# EAGLE design Big LED Controller Board (EAGLE 5.06)
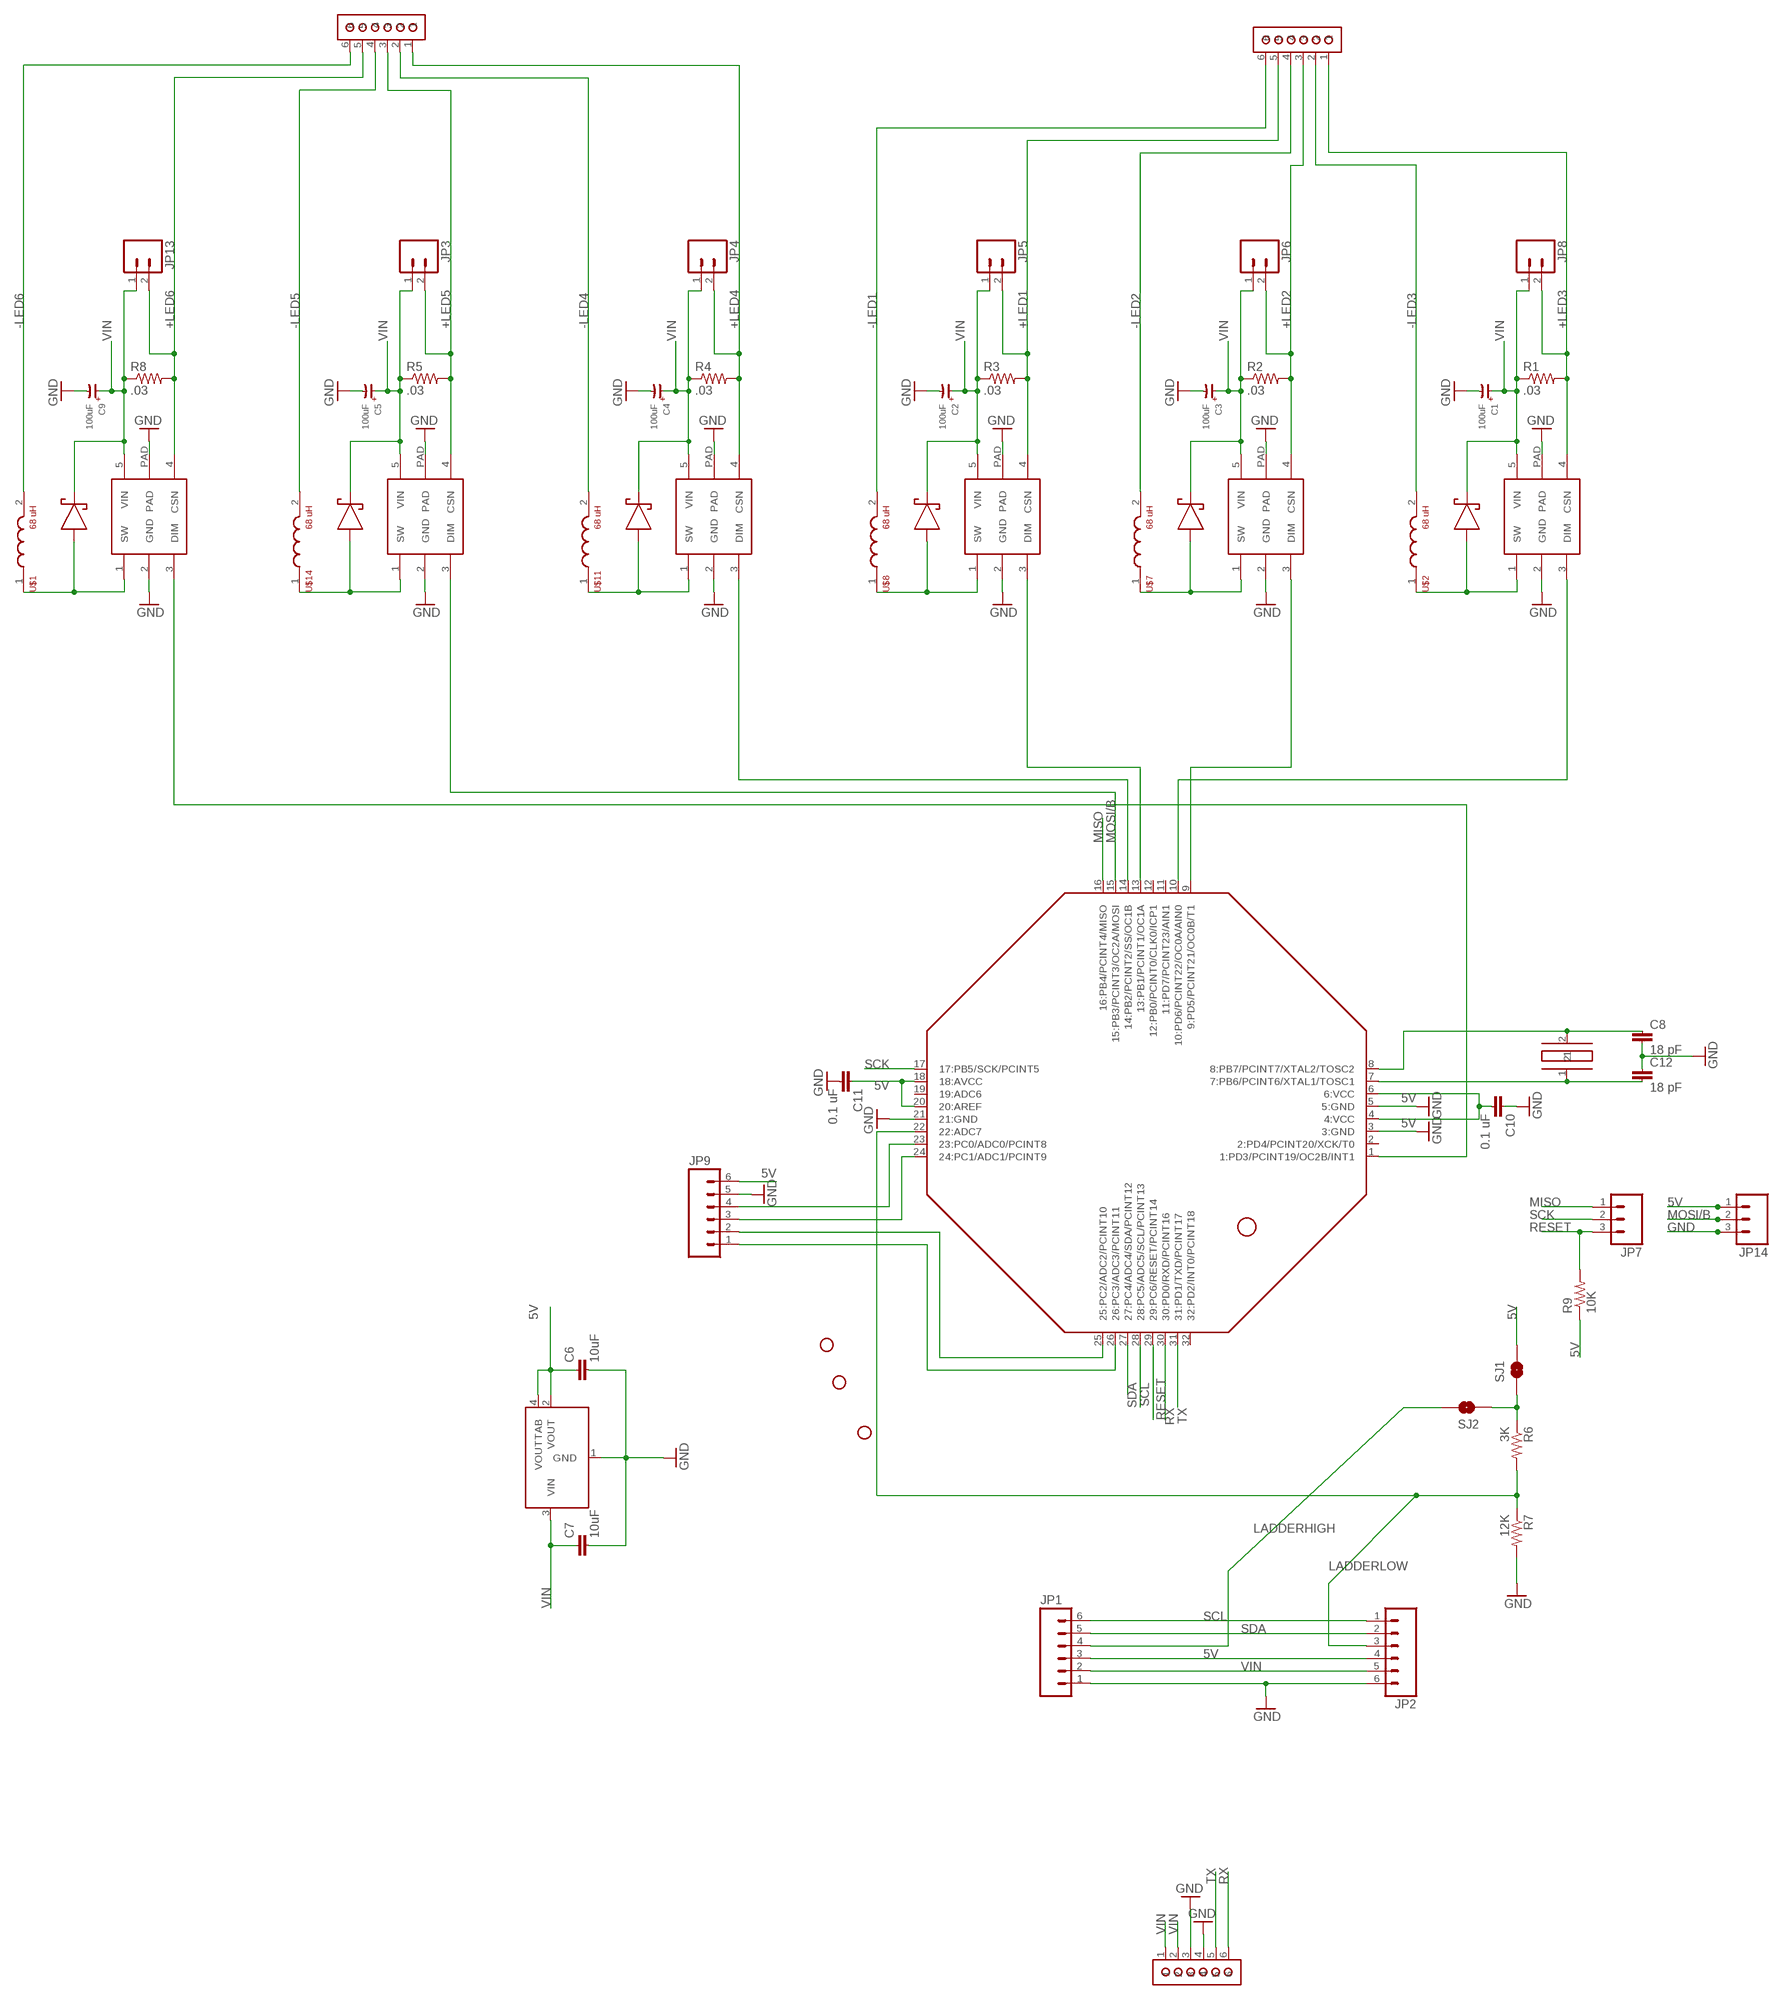
[diagram p0: schematic, sheet 1]

## Parts
C1  100uF  CAPPOL-8X11  [8MMCAP]
C2  100uF  CAPPOL-8X11  [8MMCAP]
C3  100uF  CAPPOL-8X11  [8MMCAP]
C4  100uF  CAPPOL-8X11  [8MMCAP]
C5  100uF  CAPPOL-8X11  [8MMCAP]
C6  10uF  CAP0805  [0805]
C7  10uF  CAP0805  [0805]
C8  18 pF  CAP0603-CAP  [0603-CAP]
C9  100uF  CAPPOL-8X11  [8MMCAP]
C10  0.1 uF  CAP0805  [0805]
C11  0.1 uF  CAP0805  [0805]
C12  18 pF  CAP0603-CAP  [0603-CAP]
JP1  M06_HERM  [1X06_HERM_CONN]
JP2  M06_HERM  [1X06_HERM_CONN]
JP3  M02LOCK  [1X02_LOCK]
JP4  M02LOCK  [1X02_LOCK]
JP5  M02LOCK  [1X02_LOCK]
JP6  M02LOCK  [1X02_LOCK]
JP7  M03LOCK  [1X03_LOCK]
JP8  M02LOCK  [1X02_LOCK]
JP9  M06LOCK  [1X06_LOCK]
JP10  STAND-OFFTIGHT  [STAND-OFF-TIGHT]
JP11  STAND-OFFTIGHT  [STAND-OFF-TIGHT]
JP12  STAND-OFFTIGHT  [STAND-OFF-TIGHT]
JP13  M02LOCK  [1X02_LOCK]
JP14  M03LOCK  [1X03_LOCK]
R1  .03  RESISTOR1206  [1206]
R2  .03  RESISTOR1206  [1206]
R3  .03  RESISTOR1206  [1206]
R4  .03  RESISTOR1206  [1206]
R5  .03  RESISTOR1206  [1206]
R6  3K  RESISTOR0603-RES  [0603-RES]
R7  12K  RESISTOR0603-RES  [0603-RES]
R8  .03  RESISTOR1206  [1206]
R9  10K  RESISTOR  [0805]
SJ1  SOLDERJUMPERNO  [SJ_2S-NO]
SJ2  SOLDERJUMPERNO  [SJ_2S-NO]
U$1  68 uH  INDUCTORVLF10040  [VLF10040]
U$2  68 uH  INDUCTORVLF10040  [VLF10040]
U$3  SCHOTTKY_DIODE-SS18  [DO-214]
U$4  PT4115  [SOT89-5]
U$5  PT4115  [SOT89-5]
U$6  PT4115  [SOT89-5]
U$7  68 uH  INDUCTORVLF10040  [VLF10040]
U$8  68 uH  INDUCTORVLF10040  [VLF10040]
U$9  SCHOTTKY_DIODE-SS18  [DO-214]
U$10  SCHOTTKY_DIODE-SS18  [DO-214]
U$11  68 uH  INDUCTORVLF10040  [VLF10040]
U$12  SCHOTTKY_DIODE-SS18  [DO-214]
U$13  PT4115  [SOT89-5]
U$14  68 uH  INDUCTORVLF10040  [VLF10040]
U$15  SCHOTTKY_DIODE-SS18  [DO-214]
U$16  PT4115  [SOT89-5]
U$17  5V-LDO-DPAK3  [DPAK3]
U$18  SCREWTERM-6-MA212-6  [MA212-6]
U$19  SCREWTERM-6-MA212-6  [MA212-6]
U$21  SCREWTERM-6-MA212-6  [MA212-6]
U$22  ATMEGA328TQFP  [TQFP32]
U$23  SCHOTTKY_DIODE-SS18  [DO-214]
U$24  PT4115  [SOT89-5]
U$26  HC49US  [HC49US]

## Nets
5V: C6.1 C10.2 C11.1 JP1.3 JP2.4 JP9.6 JP14.1 R9.1 SJ1.2 U$17.2(VOUT) U$17.4(VOUTTAB) U$22.4(4:VCC) U$22.6(6:VCC) U$22.18(18:AVCC) U$22.20(20:AREF)
+LED1: JP5.2 R3.2 U$4.4(CSN) U$18.5
+LED2: JP6.2 R2.2 U$5.4(CSN) U$18.3
+LED3: JP8.2 R1.2 U$6.4(CSN) U$18.1
+LED4: JP4.2 R4.2 U$13.4(CSN) U$19.1
+LED5: JP3.2 R5.2 U$16.4(CSN) U$19.3
+LED6: JP13.2 R8.2 U$19.5 U$24.4(CSN)
-LED1: U$8.2 U$18.6
-LED2: U$7.2 U$18.4
-LED3: U$2.2 U$18.2
-LED4: U$11.2 U$19.2
-LED5: U$14.2 U$19.4
-LED6: U$1.2 U$19.6
A: U$22.1(1:PD3/PCINT19/OC2B/INT1) U$24.3(DIM)
A1: JP9.4 U$22.23(23:PC0/ADC0/PCINT8)
A2: JP9.3 U$22.24(24:PC1/ADC1/PCINT9)
A3: JP9.2 U$22.25(25:PC2/ADC2/PCINT10)
A4: JP9.1 U$22.26(26:PC3/ADC3/PCINT11)
C: U$13.3(DIM) U$22.14(14:PB2/PCINT2/SS/OC1B)
D: U$4.3(DIM) U$22.13(13:PB1/PCINT1/OC1A)
E: U$5.3(DIM) U$22.9(9:PD5/PCINT21/OC0B/T1)
F: U$6.3(DIM) U$22.10(10:PD6/PCINT22/OC0A/AIN0)
GND: C1.- C2.- C3.- C4.- C5.- C6.2 C7.2 C8.2 C9.- C10.1 C11.2 C12.1 JP1.1 JP2.6 JP9.5 JP14.3 R7.2 U$4.2(GND) U$4.PAD U$5.2(GND) U$5.PAD U$6.2(GND) U$6.PAD U$13.2(GND) U$13.PAD U$16.2(GND) U$16.PAD U$17.1(GND) U$21.3 U$21.4 U$22.3(3:GND) U$22.5(5:GND) U$22.21(21:GND) U$24.2(GND) U$24.PAD
LADDERHIGH: JP1.4 SJ2.2
LADDERLOW: JP2.3 R6.2 R7.1 U$22.22(22:ADC7)
MISO: JP7.1 U$22.16(16:PB4/PCINT4/MISO)
MOSI/B: JP14.2 U$16.3(DIM) U$22.15(15:PB3/PCINT3/OC2A/MOSI)
N$5: R6.1 SJ1.1 SJ2.1
N$21: C8.1 U$22.8(8:PB7/PCINT7/XTAL2/TOSC2) U$26.2
N$22: C12.2 U$22.7(7:PB6/PCINT6/XTAL1/TOSC1) U$26.1
RESET: JP7.3 R9.2 U$22.29(29:PC6/RESET/PCINT14)
RX: U$21.6 U$22.30(30:PD0/RXD/PCINT16)
SCK: JP7.2 U$22.17(17:PB5/SCK/PCINT5)
SCL: JP1.6 JP2.1 U$22.28(28:PC5/ADC5/SCL/PCINT13)
SDA: JP1.5 JP2.2 U$22.27(27:PC4/ADC4/SDA/PCINT12)
SW1: U$4.1(SW) U$8.1 U$10.P$2(ANODE)
SW2: U$5.1(SW) U$7.1 U$9.P$2(ANODE)
SW3: U$2.1 U$3.P$2(ANODE) U$6.1(SW)
SW4: U$11.1 U$12.P$2(ANODE) U$13.1(SW)
SW5: U$14.1 U$15.P$2(ANODE) U$16.1(SW)
SW6: U$1.1 U$23.P$2(ANODE) U$24.1(SW)
TX: U$21.5 U$22.31(31:PD1/TXD/PCINT17)
VIN: C1.+ C2.+ C3.+ C4.+ C5.+ C7.1 C9.+ JP1.2 JP2.5 JP3.1 JP4.1 JP5.1 JP6.1 JP8.1 JP13.1 R1.1 R2.1 R3.1 R4.1 R5.1 R8.1 U$3.P$1(CATHODE) U$4.5(VIN) U$5.5(VIN) U$6.5(VIN) U$9.P$1(CATHODE) U$10.P$1(CATHODE) U$12.P$1(CATHODE) U$13.5(VIN) U$15.P$1(CATHODE) U$16.5(VIN) U$17.3(VIN) U$21.1 U$21.2 U$23.P$1(CATHODE) U$24.5(VIN)
Unconnected: U$22.2(2:PD4/PCINT20/XCK/T0) U$22.11(11:PD7/PCINT23/AIN1) U$22.12(12:PB0/PCINT0/CLK0/ICP1) U$22.19(19:ADC6) U$22.32(32:PD2/INT0/PCINT18)

## Library data of the parts
C1-C5 C9 = 1dah:CAPPOL
C6-C8 C10-C12 = 1dah:CAP: Capacitor Standard 0603 ceramic capacitor, and 0.1" leaded capacitor.
JP1 JP2 JP9 = 1dah:M06: Header 6 Standard 6-pin 0.1" header. Use with straight break away headers (SKU : PRT-00116), right angle break away headers (PRT-00553), swiss pins (PRT-00743), machine pins (PRT-00117), and female headers (PRT-00115). Molex polarized connector foot print use with SKU : PRT-08094 with associated crimp pins and housings. NOTES ON THE VARIANTS LOCK and LOCK_LONGPADS... This footprint was designed to help hold the alignment of a through-hole component (i.e. 6-pin header) while soldering it into place. You may notice that each hole has been shifted either up or down by 0.005 of an inch from it's more standard position (which is a perfectly straight line). This slight alteration caused the pins (the squares in the middle) to touch the edges of the holes. Because they are alternating, it causes a "brace" to hold the component in place. 0.005 has proven to be the perfect amount of "off-center" position when using our standard breakaway headers. Although looks a little odd when you look at the bare footprint, once you have a header in there, the alteration is very hard to notice. Also, if you push a header all the way into place, it is covered up entirely on the bottom side. This idea of altering the position of holes to aid alignment will be further integrated into the Sparkfun Library for other footprints. It can help hold any component with 3 or more connection pins.
JP3-JP6 JP8 JP13 = 1dah:M02: Header 2 Standard 2-pin 0.1" header. Use with straight break away headers (SKU : PRT-00116), right angle break away headers (PRT-00553), swiss pins (PRT-00743), machine pins (PRT-00117), and female headers (PRT-00115). Molex polarized connector foot print use with SKU : PRT-08233 with associated crimp pins and housings.
JP7 JP14 = 1dah:M03: Header 3 Standard 3-pin 0.1" header. Use with straight break away headers (SKU : PRT-00116), right angle break away headers (PRT-00553), swiss pins (PRT-00743), machine pins (PRT-00117), and female headers (PRT-00115). Molex polarized connector foot print use with SKU : PRT-08232 with associated crimp pins and housings.
JP10-JP12 = 1dah:STAND-OFF: Stand Off This is the mechanical footprint for a #4 phillips button head screw. Use the keepout ring to avoid running the screw head into surrounding components. SKU : PRT-00447
R1-R9 = 1dah:RESISTOR: Resistor Basic schematic elements and footprints for 0603, 1206, and PTH 1/10th watt (small) resistors.
SJ1 SJ2 = SparkFun:SOLDERJUMPER: Solder Jumper Standard SMD solder jumper. Used to automate production. Two varients : Normally Open and Normally Closed are the same, but have different paste layers. NC will have a large amount of paste and should jumper during reflow.
U$1 U$2 U$7 U$8 U$11 U$14 = 1dah:INDUCTOR
U$3 U$9 U$10 U$12 U$15 U$23 = 1dah:SCHOTTKY_DIODE: 40V, 1A schottky diode
U$4-U$6 U$13 U$16 U$24 = 1dah:PT4115: Small switching mode constant current PS
U$17 = 1dah:5V-LDO: 5 V LDO, 12V input, 1 A
U$18 U$19 U$21 = 1dah:SCREWTERM-6
U$22 = 1dah:ATMEGA328TQFP
U$26 = 1dah:HC49US: 16 MHz crystal

## Board
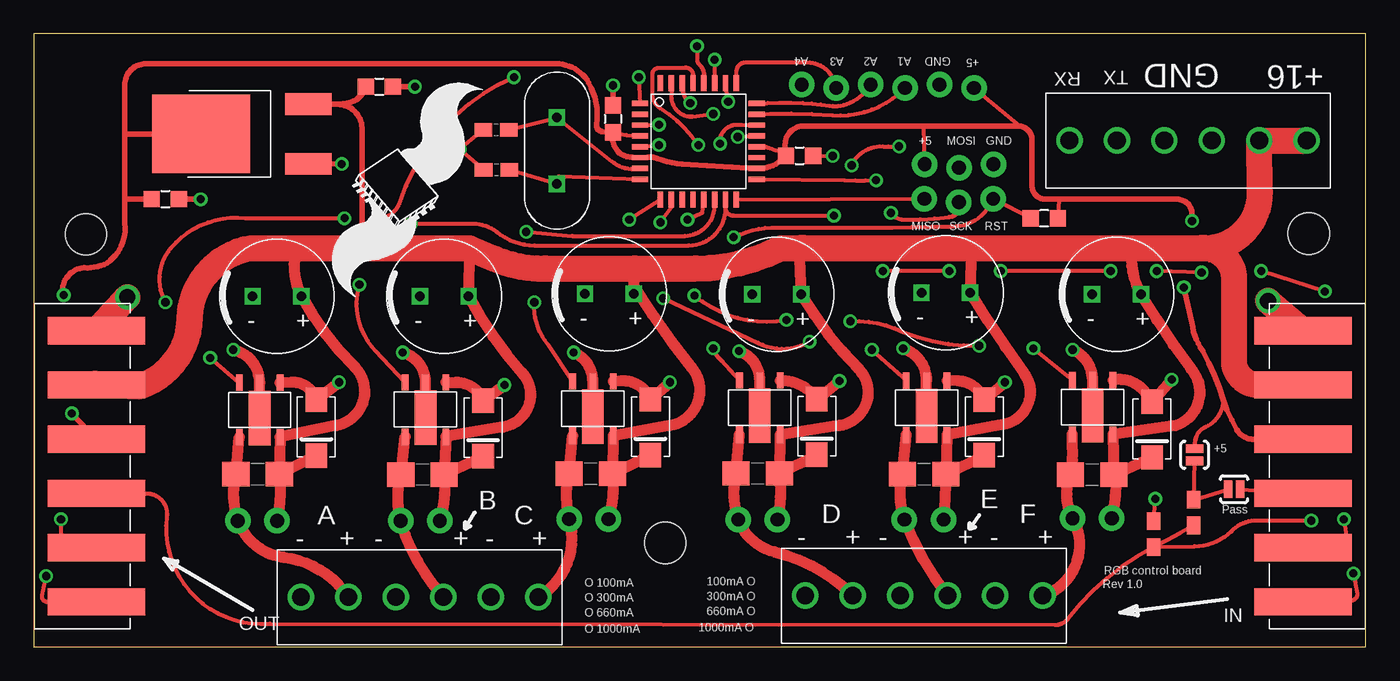
[diagram p1: board, top side]
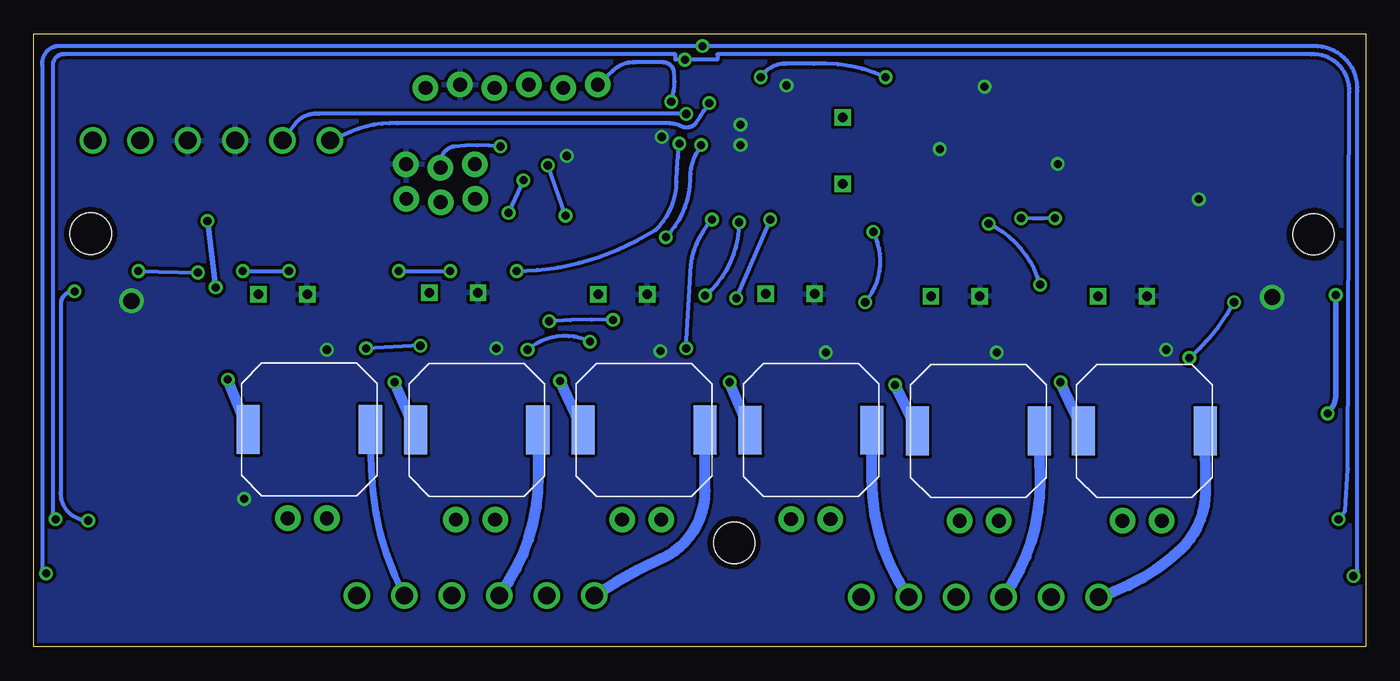
[diagram p2: board, bottom side, seen from below]

Size 98.2 x 45.2 mm. Coordinates in mm from the lower left corner, seen from the top.
Outline: 0,0 98.2,0 98.2,45.2 0,45.2 0,0
Copper layers (1*16): Top 0.0356mm / dielectric 1.5011mm / Bottom 0.0356mm
Design rules "goldenpcb": minimum track width 9mil, minimum drill 18mil, track to track 9mil, track to pad 9mil, pad to pad 9mil, via to via 9mil, smd to smd 9mil, copper to edge 10mil, drill to drill 9mil, minimum pad ring 10mil, minimum via ring 8mil, stop-mask expansion 4mil, vias tented up to drill 25mil, thermal gap 10mil

### Footprints (pad centres in the part's own frame; a part is rotated, then mirrored left to right if it is on the bottom)
8MMCAP = drill 0.7 square: + 1.8,0; - -1.8,0
0805 = smd 1.2 x 1.2: 1 -1,0; 2 1,0
0603-CAP = smd 1.3 x 1: 1 -0.95,0; 2 0.95,0
1X06_HERM_CONN = smd 2 x 7.2: 1 -10,-4.6; 2 -6,-4.6; 3 -2,-4.6; 4 2,-4.6; 5 6,-4.6; 6 10,-4.6
1X02_LOCK = drill 1.016 pad 1.88 round: 1 -0.178,0; 2 2.718,0
1X03_LOCK = drill 1.016 pad 1.88 round: 1 0,0.127; 2 2.54,-0.127; 3 5.08,0.127
1X06_LOCK = drill 1.016 pad 1.88 round: 1 0,0; 2 2.54,-0.254; 3 5.08,0; 4 7.62,-0.254; 5 10.16,0; 6 12.7,-0.254
STAND-OFF-TIGHT = hole 3.048: 0,0
1206 = smd 2 x 1.8: 1 -1.6,0; 2 1.6,0
0603-RES = smd 1.3 x 1: 1 -0.95,0; 2 0.95,0
SJ_2S-NO = smd 0.635 x 1.27: 1 -0.45,0; 2 0.45,0
VLF10040 = smd 1.7 x 3.6: 1 -4.5,0; 2 4.5,0
DO-214 = smd 1.8 x 1.6: P$1 -2.1,0; P$2 2,0
SOT89-5 = smd 0.5 x 1.2: 1 -1.5,-2; 2 0,-2; 3 1.5,-2; 4 1.5,2; 5 -1.5,2 | smd 1.6 x 4: PAD 0,0.6
DPAK3 = smd 1.6 x 3.4: 1 -2.2,-7.4; 3 2.2,-7.4 | smd 5.8 x 6.2: 2 0,0 | smd 5.8 x 1: 4 0,3.6
MA212-6 = drill 1.3 round: 1 -8.75,-0.01; 2 -5.25,-0.01; 3 -1.75,-0.01; 4 1.75,-0.01; 5 5.25,-0.01; 6 8.75,-0.01
TQFP32 = smd 1.2 x 0.4: 1 -4.3,2.8; 2 -4.3,2; 3 -4.3,1.2; 4 -4.3,0.4; 5 -4.3,-0.4; 6 -4.3,-1.2; 7 -4.3,-2; 8 -4.3,-2.8; 17 4.3,-2.8; 18 4.3,-2; 19 4.3,-1.2; 20 4.3,-0.4; 21 4.3,0.4; 22 4.3,1.2; 23 4.3,2; 24 4.3,2.8 | smd 0.4 x 1.2: 9 -2.8,-4.3; 10 -2,-4.3; 11 -1.2,-4.3; 12 -0.4,-4.3; 13 0.4,-4.3; 14 1.2,-4.3; 15 2,-4.3; 16 2.8,-4.3; 25 2.8,4.3; 26 2,4.3; 27 1.2,4.3; 28 0.4,4.3; 29 -0.4,4.3; 30 -1.2,4.3; 31 -2,4.3; 32 -2.8,4.3
HC49US = drill 0.7 square: 1 -2.44,0; 2 2.44,0

### Placement (x,y rotation side)
C1  17.93,25.85 0 top
C2  30.25,25.85 0 top
C3  42.44,26.02 0 top
C4  54.78,25.98 0 top
C5  67.25,26.11 0 top
C6  9.69,33.01 0 top
C7  25.48,41.31 0 top
C8  34.11,35.18 180 top
C9  79.84,25.99 0 top
C10  42.71,38.93 270 top
C11  56.46,36.21 0 top
C12  34.08,38.12 0 top
JP1  98.19,13.3 270 top
JP2  0.01,13.3 90 top
JP3  29.76,9.28 180 top
JP4  42.19,9.41 180 top
JP5  54.65,9.37 180 top
JP6  66.91,9.37 180 top
JP7  65.66,32.91 0 top
JP8  79.31,9.47 180 top
JP9  56.62,41.46 0 top
JP10  94.01,30.47 0 top
JP11  46.56,7.66 0 top
JP12  3.84,30.42 0 top
JP13  17.75,9.28 180 top
JP14  65.68,35.46 0 top
R1  78.04,12.68 180 top
R2  65.64,12.71 180 top
R3  53.38,12.78 180 top
R4  41.06,12.75 180 top
R5  28.66,12.7 180 top
R6  85.52,9.89 270 top
R7  82.58,8.3 90 top
R8  16.5,12.73 180 top
R9  74.5,31.6 180 top
SJ1  85.59,14.15 90 top
SJ2  88.5,11.61 0 top
U$1  16.31,15.9 0 bottom
U$2  77.89,16.03 0 bottom
U$3  82.45,16.06 90 top
U$4  53.53,17.63 180 top
U$5  65.83,17.62 180 top
U$6  78.07,17.66 180 top
U$7  65.54,15.99 0 bottom
U$8  53.21,15.99 0 bottom
U$9  70.08,16.22 90 top
U$10  57.73,16.25 90 top
U$11  40.89,15.97 0 bottom
U$12  45.46,16.23 90 top
U$13  41.22,17.56 180 top
U$14  28.55,15.9 0 bottom
U$15  33.12,16.14 90 top
U$16  28.88,17.49 180 top
U$17  12.84,37.82 90 top
U$18  65.64,3.75 180 top
U$19  28.45,3.65 180 top
U$20  [MTECHLOGO1]  26.65,33.87 240 top
U$21  85.11,37.33 180 top
U$22  49,37.27 0 top
U$23  20.82,16.2 90 top
U$24  16.65,17.46 180 top
U$26  38.57,36.59 270 top

### Tracks (layer width: path | path; a pad name or v marks a point on that pad's centre or on a via)
5V  (via drill 0.6)
  Top 0.305: 44.1,36.1 44.2,36.1 44.2,36.07 U$22.6 arc6 45.3,36.1 | U$22.4 44.2,37.7 arc-11 C10.2 | C11.1 55,36.5 arc3 54.1,36.8 arc41 U$22.20 | 72.7,38.4 JP9.6 | 65.6,38.4 JP14.1 | 75.6,33 R9.1 | SJ1.2 85.6,15 arc-65 86.4,16.2 arc66 87.7,18.2
  Top 0.406: JP2.4 v2.8,17.2 | v2.2,25.94 2.1,26.08 arc-90 3.71,27.95 arc31 5.4,28.29 arc62 6.7,31.2 6.7,33 | 6.7,33 6.7,37.8 | 6.7,37.8 6.7,41.4 arc-92 8.3,43 38.5,43 arc-60 40.9,41.6 arc-37 41.5,38.5 arc93 41.9,38 C10.2 arc106 44.1,36.1 | 6.7,37.8 U$17.4 U$17.2 | 45.3,36.1 arc-28 46,36 arc19 47.8,35.6 arc-1 U$22.18 arc50 C11.1 55.4,36.9 arc-96 56.8,38.4 65.6,38.4 72.7,38.4 arc-90 73.6,37.2 73.6,34 arc90 74.6,33 75.6,33 84.3,33 arc-95 85.4,31.8 arc10 v85.4,31.4 | v84.8,26.5 85.4,23.9 arc31 86.2,21.8 arc-13 87.7,18.2 arc12 88.7,16 arc66 90.1,15.3 arc-13 JP1.3 | C6.1 6.7,33.01 6.7,33
  Bottom 0.406: v2.8,17.2 arc-49 2.2,18.8 v2.2,25.94 | v85.4,31.4 v84.8,26.5
+LED1
  Top 0.813: U$4.4 R3.2 arc30 JP5.2 arc55 54.6,7 arc-30 U$18.5
+LED2
  Top 0.813: U$5.4 R2.2 arc31 JP6.2 arc16 U$18.3
+LED3
  Top 0.813: U$6.4 76.57,14.81 arc-18 R1.2 arc48 JP8.2 arc-102 U$18.1
+LED4
  Top 0.813: U$13.4 R4.2 arc26 JP4.2 arc-76 U$19.1
+LED5
  Top 0.813: U$16.4 R5.2 arc27 JP3.2 arc25 U$19.3
+LED6
  Top 0.813: U$24.4 R8.2 arc30 JP13.2 arc62 18.4,6.6 arc-48 U$19.5
-LED1
  Bottom 0.813: U$8.2 48.7,11.5 arc65 51.9,6.5 arc-8 U$18.6
-LED2
  Bottom 0.813: U$7.2 61,12.6 arc38 U$18.4
-LED3
  Bottom 0.5: U$2.2 73.3,13.1 arc-25 U$18.2
-LED4
  Bottom 0.813: U$11.2 36.4,12.4 arc-35 U$19.2
-LED5
  Bottom 0.813: U$14.2 24,12.2 arc37 U$19.4
-LED6
  Bottom 0.813: U$1.2 11.8,11.4 arc47 13.6,7.2 arc27 U$19.6
A  (via drill 0.6)
  Top 0.305: U$24.3 v13,21.3 | v9.7,25.4 arc-68 10.1,29.4 arc-57 15.6,31.6 v22.9,31.6 | v25.4,31.6 arc69 27,32.8 arc-48 v35.4,42 | v44.6,42 U$22.1
  Bottom 0.305: v13,21.3 arc-21 v9.7,25.4 | v22.9,31.6 arc5 v25.4,31.6 | v35.4,42 arc-28 40.7,43 42.8,43 arc-58 v44.6,42
A1
  Top 0.305: U$22.23 54.3,39.3 arc-6 58.9,39.2 arc50 JP9.4
A2
  Top 0.305: U$22.24 54.1,40.1 arc-4 56.7,40.1 arc-7 58.7,39.9 arc28 59.9,40 arc40 JP9.3
A3
  Top 0.305: U$22.25 51.8,42.4 arc-98 52.6,43.1 57,43.1 arc-82 JP9.2
A4  (via drill 0.6)
  Top 0.305: v51.2,40.2 U$22.26
  Bottom 0.305: JP9.1 55.5,42.5 arc47 53.8,43.1 51.8,43.1 arc82 51,42.4 arc26 v51.2,40.2
C  (via drill 0.6)
  Top 0.305: U$13.3 37.9,22.3 arc-44 v36.9,25.4 | v36.3,30.6 39.7,30.3 48,30.3 arc90 50.2,32.6 U$22.14
  Bottom 0.305: v36.9,25.4 arc-68 v36.3,30.6
D  (via drill 0.6)
  Top 0.305: U$4.3 50.7,21.1 arc-34 v50.1,22 | v48.2,31.5 49.3,32 U$22.13
  Bottom 0.305: v50.1,22 49.8,27.6 arc38 v48.2,31.5
E  (via drill 0.6)
  Top 0.305: v61.8,21.9 U$5.3 | v57.2,22.5 arc-57 53.4,22.4 v46.4,25.7 | v43.9,31.5 U$22.9
  Bottom 0.305: v57.2,22.5 arc-66 v61.8,21.9 | v46.4,25.7 v43.9,31.5
F  (via drill 0.6)
  Top 0.305: v73.7,22 U$6.3 | v69.7,22.2 arc-23 64.1,23.2 arc30 v60.2,24 | v48.7,25.9 arc49 v55.5,24.1 | v46.2,31.3 47,32.4 U$22.10
  Bottom 0.305: v69.7,22.2 v73.7,22 | v55.5,24.1 arc-6 v60.2,24 | v48.7,25.9 arc-51 v46.2,31.3
GND  (via drill 0.6, 1.2)
  Top 0.305: C12.1 v31.4,36.7 C8.2 | U$22.3 v46.1,38.5 | U$22.21 v51.9,37.6 | U$22.5 v46.1,37 | C11.2 v58.9,36.2 | R7.2 v82.7,10.9
  Top 0.406: U$17.1 v22.7,35.6 | C6.2 v12.3,33.01 v12.3,33 | C7.2 v28.1,41.3 | C10.1 v42.7,41.4
  Top 0.813: U$6.PAD U$6.2 arc67 v76.6,21.9 | U$5.PAD U$5.2 arc72 v64.1,22 | U$4.PAD U$4.2 arc70 v52,21.8 | U$13.PAD U$13.2 arc67 v39.8,21.7 | U$16.PAD U$16.2 arc74 v27.2,21.7 | U$24.PAD U$24.2 arc77 v14.7,21.9
  Top 1.93: JP2.6 v6.89,25.78 | JP1.1 v91,25.5
  pour Bottom: -35.56,130.81 215.9,130.81 215.9,-36.83 -35.56,-36.83 -35.56,129.54
LADDERHIGH
  Top 0.305: SJ2.2 JP1.4
LADDERLOW  (via drill 0.6)
  Top 0.305: JP2.3 8.3,11.3 arc-97 9.8,9.6 arc102 17.4,1.7 75.3,1.6 arc52 76.3,2.1 arc-25 R7.1 | R7.1 arc2 R6.2 | R7.1 85.6,7.4 arc42 88.3,8.5 arc-50 90.2,9.3 v94.2,9.3 | U$22.22 52.2,38.5 arc3 51.8,38.5 arc96 v50.6,37.1 | v67.5,27.7 v62.6,27.7 | v79.4,27.7 v71.3,27.7 | v86.1,27.6 v82.8,27.7 | v95.2,26.2 v90.5,27.7
  Bottom 0.305: v94.2,9.3 arc95 96.2,11.5 96.2,25.3 arc96 v95.2,26.2 | v50.6,37.1 arc-6 50.8,34.3 arc46 52.4,30.7 arc31 v62.6,27.7 | v71.3,27.7 v67.5,27.7 | v82.8,27.7 v79.4,27.7 | v90.5,27.7 v86.1,27.6
MISO
  Top 0.305: U$22.16 JP7.1
MOSI/B  (via drill 0.6)
  Top 0.305: U$16.3 25.2,21.8 arc-59 v24,26.7 | v27.8,31.2 32.4,31.2 arc-39 34.1,30.6 arc38 36.9,29.6 arc1 48.3,29.6 arc95 51,32.6 arc-11 U$22.15 51,32.3 arc90 51.6,31.8 v59,31.8 | v60.3,35.5 arc-68 62.6,36.9 arc4 v63.8,36.9
  Bottom 0.305: v24,26.7 arc-49 v27.8,31.2 | v59,31.8 v60.3,35.5 | v63.8,36.9 arc-12 67.2,36.9 arc-95 JP14.2
N$5
  Top 0.305: SJ1.1 R6.1 SJ2.1
N$21
  Top 0.305: U$22.8 44.67,34.5 38.7,34.7 38.55,34.55 U$26.2 C8.1
N$22
  Top 0.305: C12.2 U$26.1 42.6,35.8 arc49 U$22.7
RESET  (via drill 0.6)
  Top 0.305: R9.2 JP7.3 arc-69 67.7,31 arc2 63.3,30.9 54.4,30.9 arc24 52.1,30.4 v51.6,30.2 | U$22.29 48.6,42.2 arc100 48,42.7 46.1,42.7 arc90 45.6,42.2 45.6,40.8 arc57 46.2,39.7 arc-22 v49,37
  Bottom 0.305: v49,37 arc-34 49.8,34.5 arc44 v51.6,30.2
RX  (via drill 0.6)
  Top 0.305: U$22.30 arc61 v48.4,40.1
  Bottom 0.305: U$21.6 74.8,38 arc26 71.4,38.6 51.3,38.6 arc28 50.5,38.4 arc-77 49.4,38.6 arc3 v48.4,40.1
SCK  (via drill 0.6)
  Top 0.305: U$22.17 59.8,34.4 arc1 v62.1,34.4 | v63.2,32 arc62 64.3,31.5 arc8 67.5,31.7 arc112 JP7.2
  Bottom 0.305: v62.1,34.4 v63.2,32
SCL  (via drill 0.6)
  Top 0.305: JP2.1 1,3.3 arc-103 0.6,3.8 v0.9,5.2 | v97.3,5.4 97.6,3.9 arc-100 97,3.4 arc24 JP1.6 | U$22.28 49.4,42.2 arc46 49.1,42.9 arc-49 48.9,43.4 v48.9,44.3
  Bottom 0.305: v0.9,5.2 0.9,5.3 0.6,5.6 0.6,41 arc-93 3.8,44.3 v48.9,44.3 96.2,44.3 arc-100 97.6,42.9 97.6,5.7 v97.3,5.4
SDA  (via drill 0.6)
  Top 0.305: JP2.2 2.8,7.5 arc-81 2,8.6 v2,9.4 | v96.6,9.4 96.8,8 JP1.5 | v50.2,43.3 U$22.27
  Bottom 0.305: v2,9.4 1.5,10 1.3,13.1 1.2,40.9 arc-94 4,43.7 47.8,43.7 47.8,43.3 v50.2,43.3 50.9,43.3 50.9,43.7 96,43.7 arc-96 96.8,42.8 96.8,9.7 96.6,9.5 v96.6,9.4
SW1  (via drill 0.6)
  Top 0.813: U$4.1 55.4,19.6 arc-51 U$10.P$2 v59.4,19.6
  Bottom 0.813: U$8.1 v59.4,19.6
SW2  (via drill 0.6)
  Top 0.813: U$5.1 68.1,19.6 arc-67 U$9.P$2 v71.6,19.5
  Bottom 0.813: U$7.1 v71.6,19.5
SW3  (via drill 0.6)
  Top 0.5: U$3.P$2 82,18.7
  Top 0.813: v83.9,19.7 U$3.P$2 | 82,18.7 arc67 U$6.1
  Bottom 0.813: U$2.1 v83.9,19.7
SW4  (via drill 0.6)
  Top 0.813: U$13.1 43.3,19.6 arc-73 U$12.P$2 v46.9,19.5
  Bottom 0.813: U$11.1 v46.9,19.5
SW5  (via drill 0.6)
  Top 0.813: U$16.1 31.1,19.5 arc-69 U$15.P$2 v34.7,19.3
  Bottom 0.813: v34.7,19.3 U$14.1
SW6  (via drill 0.6)
  Top 0.813: U$24.1 19,19.5 arc-77 U$23.P$2 v22.5,19.5
  Bottom 0.813: U$1.1 v22.5,19.5
TX  (via drill 0.6)
  Top 0.305: v50.1,39.3 48.6,39.1 arc-99 47,40.7 U$22.31
  Bottom 0.305: U$21.5 79,38.5 arc59 77.2,39.3 v50.1,39.3
VIN
  Top 0.406: 22.4,40 U$17.3 | 22.4,40 arc-92 24.2,38.1 24.2,29.4 | 22.4,40 23.1,40.1 arc66 C7.1
  Top 0.5: R1.1 79.8,12
  Top 0.813: U$3.P$1 R1.1 U$6.5 84.2,16.3 arc113 85.3,20.5 arc-6 C9.+ arc-40 81,29.4 | 79.8,12 arc-7 JP8.1 | R2.1 U$5.5 71.5,16.4 arc116 73,20.2 arc-5 C5.+ 69.1,29.4 | R2.1 U$9.P$1 | R2.1 JP6.1 | R3.1 U$4.5 59.4,16.3 arc126 60.8,20.5 arc-14 C4.+ 56.4,29.4 | R3.1 arc-18 JP5.1 | R3.1 U$10.P$1 | R4.1 U$13.5 46.9,16.3 arc119 48.5,20.6 arc-7 44.23,26.6 | R4.1 arc-22 JP4.1 | R4.1 U$12.P$1 | R5.1 U$16.5 34.6,16.2 arc122 36,20.2 arc-14 C2.+ 32.1,29.4 | R5.1 arc-21 JP3.1 | R5.1 U$15.P$1 | R8.1 U$24.5 22.3,16.3 arc124 23.6,20.7 arc-17 C1.+ arc-46 19.4,29.4 | R8.1 arc-19 JP13.1 | R8.1 U$23.P$1 | 44.23,26.6 C3.+ | 44.3,27.9 44.23,26.6
  Top 1.93: 56.9,29.4 56.4,29.4 | 56.9,29.4 69.1,29.4 81,29.4 85.9,29.4 | 4.5,19.4 JP2.5 5.3,19.3 7.8,19.2 arc70 11.5,24.2 arc-79 16,29.4 19.4,29.4 24.2,29.4 32.1,29.4 34,28.6 arc24 37.7,27.9 44.3,27.9 48.8,27.9 arc27 55.1,29.4 56.9,29.4 | JP1.2 90.4,19.3 arc-80 88.5,20.8 88.5,27.1 arc97 85.9,29.4 | U$21.1 U$21.2 90.4,33.5 arc-97 85.9,29.4

### Text on the board
tPlace: A4 | A3 | A2 | A1 | GND | +5 | GND | +16 | RX | TX | +5 | MOSI | GND | MISO | SCK | RST | +5 | B | E | Pass | A | C | D | F | - | + | - | + | - | + | - | + | - | + | - | + | RGB control board | O 100mA | 100mA O | Rev 1.0 | O 300mA | 300mA O | O 660mA | 660mA O | IN | OUT | O 1000mA | 1000mA O